# EAGLE design OpenSegment-v10 (EAGLE 6.2)
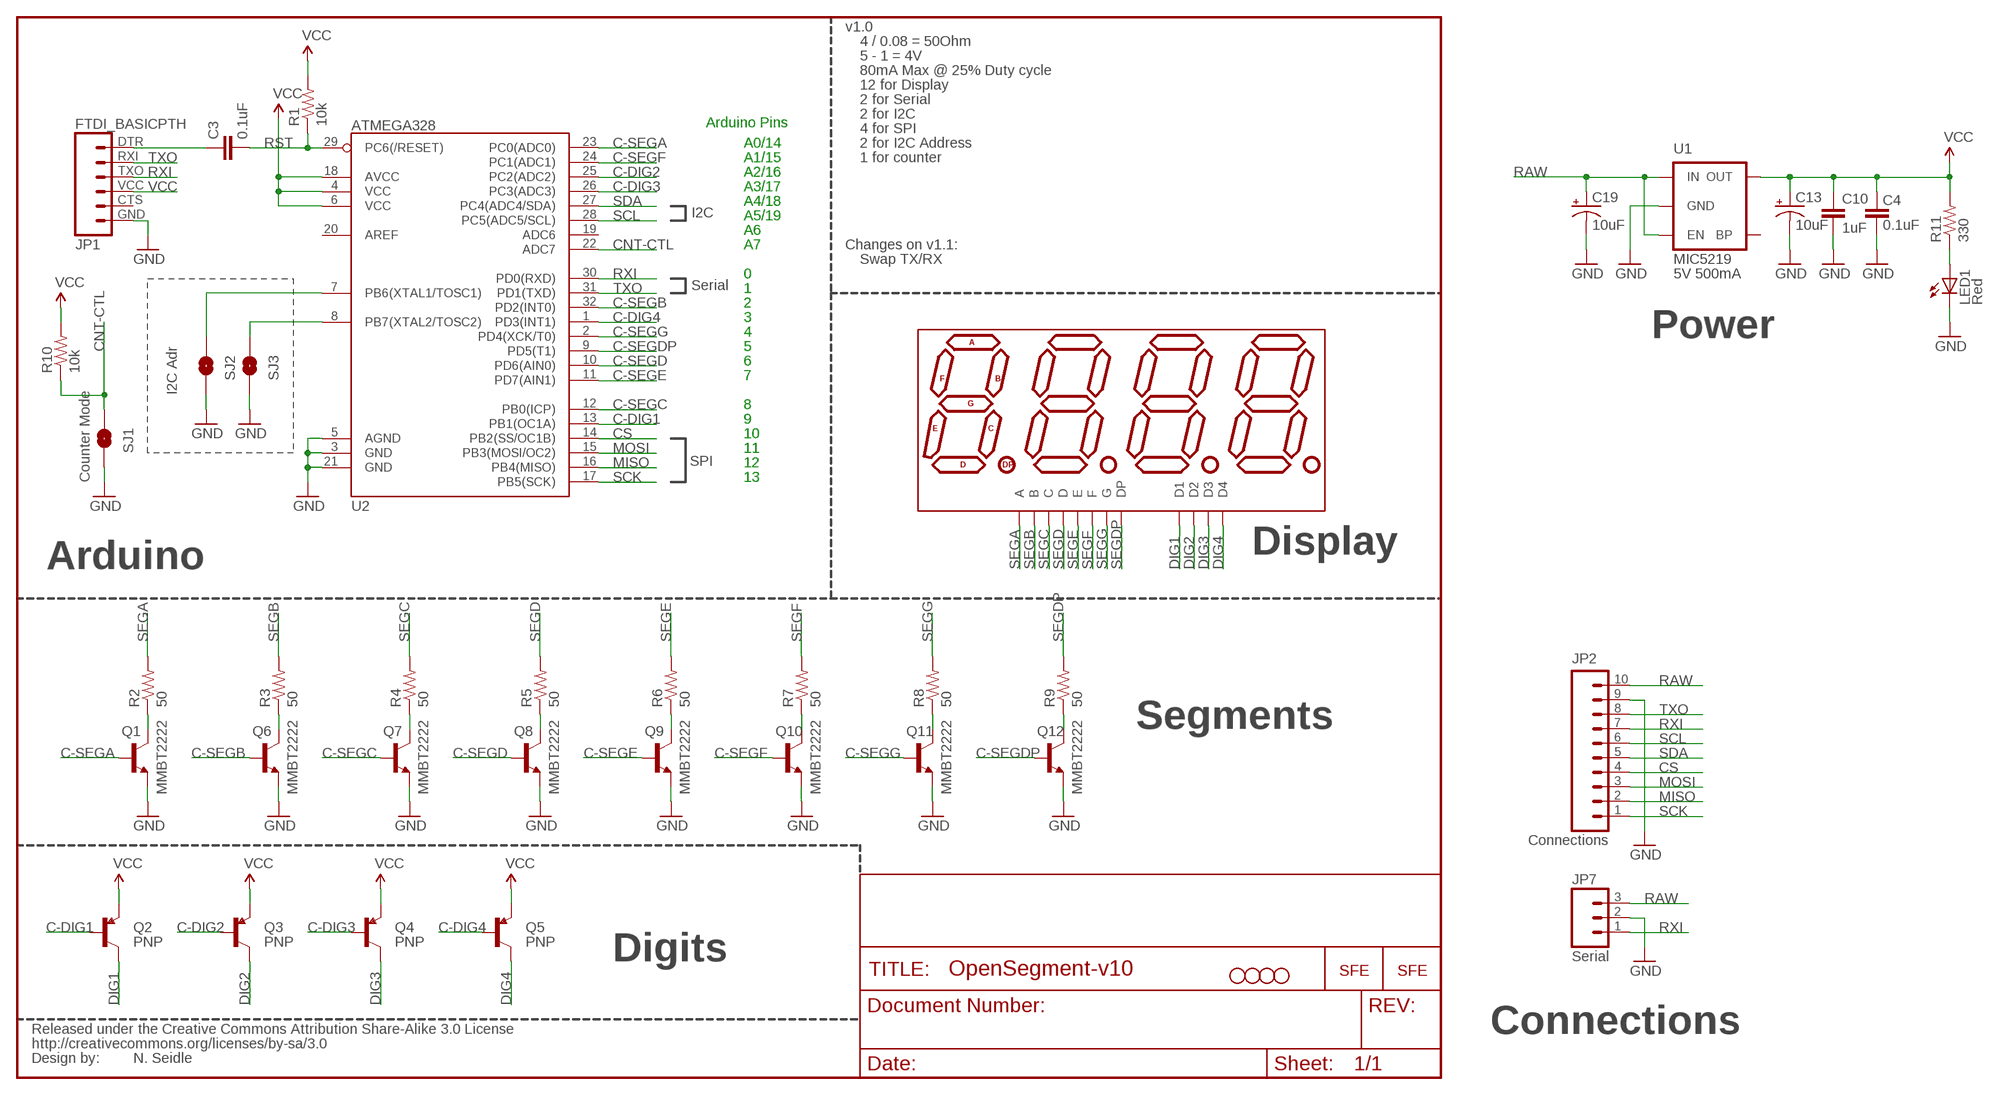
[diagram p0: schematic, sheet 1]

## Parts
C3  0.1uF  CAP0402-CAP  [0402-CAP]
C4  0.1uF  CAP0402-CAP  [0402-CAP]
C10  1uF  CAP0402-CAP  [0402-CAP]
C13  10uF  CAP_POL1206  [EIA3216]
C19  10uF  CAP_POL1206  [EIA3216]
JP1  FTDI_BASICPTH  [FTDI_BASIC]
JP2  Connections  M10"  [1X10]
JP3  STAND-OFF  [STAND-OFF]
JP4  STAND-OFF  [STAND-OFF]
JP5  STAND-OFF  [STAND-OFF]
JP6  STAND-OFF  [STAND-OFF]
JP7  Serial  M03  [JST-3-SMD]
LED1  Red  LED0603  [LED-0603]
Q1  MMBT2222  TRANSISTOR_NPNSOT23-3  [SOT23-3]
Q2  PNP  TRANSISTOR_PNPSMD  [SOT23-3]
Q3  PNP  TRANSISTOR_PNPSMD  [SOT23-3]
Q4  PNP  TRANSISTOR_PNPSMD  [SOT23-3]
Q5  PNP  TRANSISTOR_PNPSMD  [SOT23-3]
Q6  MMBT2222  TRANSISTOR_NPNSOT23-3  [SOT23-3]
Q7  MMBT2222  TRANSISTOR_NPNSOT23-3  [SOT23-3]
Q8  MMBT2222  TRANSISTOR_NPNSOT23-3  [SOT23-3]
Q9  MMBT2222  TRANSISTOR_NPNSOT23-3  [SOT23-3]
Q10  MMBT2222  TRANSISTOR_NPNSOT23-3  [SOT23-3]
Q11  MMBT2222  TRANSISTOR_NPNSOT23-3  [SOT23-3]
Q12  MMBT2222  TRANSISTOR_NPNSOT23-3  [SOT23-3]
R1  10k  RESISTOR0402-RES  [0402-RES]
R2  50  RESISTOR0402-RES  [0402-RES]
R3  50  RESISTOR0402-RES  [0402-RES]
R4  50  RESISTOR0402-RES  [0402-RES]
R5  50  RESISTOR0402-RES  [0402-RES]
R6  50  RESISTOR0402-RES  [0402-RES]
R7  50  RESISTOR0402-RES  [0402-RES]
R8  50  RESISTOR0402-RES  [0402-RES]
R9  50  RESISTOR0402-RES  [0402-RES]
R10  10k  RESISTOR0402-RES  [0402-RES]
R11  330  RESISTOR0402-RES  [0402-RES]
SJ1  Counter Ctl  SOLDERJUMPERNO  [SJ_2S-NO]
SJ2  Counter Ctl  SOLDERJUMPERNO  [SJ_2S-NO]
SJ3  Counter Ctl  SOLDERJUMPERNO  [SJ_2S-NO]
U1  MIC5219  V_REG_LDOSMD  [SOT23-5]
U2  ATMEGA328  ATMEGA168  [TQFP32-08]
U3  7-SEGMENT-4DIGIT-COUNTERPTH  [7-SEGMENT-4DIGIT-COUNTER]
U$1  LOGO-SFESK  [SFE-LOGO-FLAME]
U$3  CREATIVE_COMMONS  [CREATIVE_COMMONS]
U$7  LOGO-SFENW2  [SFE-NEW-WEB]

## Nets
C-DIG1: Q2.1(B) U2.13(PB1(OC1A))
C-DIG2: Q3.1(B) U2.25(PC2(ADC2))
C-DIG3: Q4.1(B) U2.26(PC3(ADC3))
C-DIG4: Q5.1(B) U2.1(PD3(INT1))
C-SEGA: Q1.1(B) U2.23(PC0(ADC0))
C-SEGB: Q6.1(B) U2.32(PD2(INT0))
C-SEGC: Q7.1(B) U2.12(PB0(ICP))
C-SEGD: Q8.1(B) U2.10(PD6(AIN0))
C-SEGDP: Q12.1(B) U2.9(PD5(T1))
C-SEGE: Q9.1(B) U2.11(PD7(AIN1))
C-SEGF: Q10.1(B) U2.24(PC1(ADC1))
C-SEGG: Q11.1(B) U2.2(PD4(XCK/T0))
CNT-CTL: R10.1 SJ1.1 U2.22(ADC7)
CS: JP2.4 U2.14(PB2(SS/OC1B))
DIG1: Q2.3(C) U3.12(D1)
DIG2: Q3.3(C) U3.9(D2)
DIG3: Q4.3(C) U3.8(D3)
DIG4: Q5.3(C) U3.6(D4)
GND: C4.1 C10.2 C13.C(-) C19.C(-) JP1.GND JP2.9 JP7.2 LED1.C Q1.2(E) Q6.2(E) Q7.2(E) Q8.2(E) Q9.2(E) Q10.2(E) Q11.2(E) Q12.2(E) SJ1.2 SJ2.2 SJ3.2 U1.2(GND) U2.3(GND) U2.5(AGND) U2.21(GND)
MISO: JP2.2 U2.16(PB4(MISO))
MOSI: JP2.3 U2.15(PB3(MOSI/OC2))
N$1: Q1.3(C) R2.1
N$2: SJ3.1 U2.8(PB7(XTAL2/TOSC2))
N$3: C3.1 JP1.DTR
N$4: Q6.3(C) R3.1
N$5: Q7.3(C) R4.1
N$6: Q8.3(C) R5.1
N$7: Q9.3(C) R6.1
N$8: Q10.3(C) R7.1
N$9: Q11.3(C) R8.1
N$10: Q12.3(C) R9.1
N$18: SJ2.1 U2.7(PB6(XTAL1/TOSC1))
N$38: LED1.A R11.1
RAW [vcc]: C19.A(+) JP2.10 JP7.3 U1.1(IN) U1.3(EN)
RST: C3.2 R1.1 U2.29(PC6(/RESET))
RXI: JP1.TXO JP2.7 JP7.1 U2.30(PD0(RXD))
SCK: JP2.1 U2.17(PB5(SCK))
SCL: JP2.6 U2.28(PC5(ADC5/SCL))
SDA: JP2.5 U2.27(PC4(ADC4/SDA))
SEGA: R2.2 U3.11(A)
SEGB: R3.2 U3.7(B)
SEGC: R4.2 U3.4(C)
SEGD: R5.2 U3.2(D)
SEGDP: R9.2 U3.3(DP)
SEGE: R6.2 U3.1(E)
SEGF: R7.2 U3.10(F)
SEGG: R8.2 U3.5(G)
TXO: JP1.RXI JP2.8 U2.31(PD1(TXD))
VCC: C4.2 C10.1 C13.A(+) JP1.VCC Q2.2(E) Q3.2(E) Q4.2(E) Q5.2(E) R1.2 R10.2 R11.2 U1.5(OUT) U2.4(VCC) U2.6(VCC) U2.18(AVCC)
Unconnected: JP1.CTS U1.4(BP) U2.19(ADC6) U2.20(AREF)

## Notes on the sheet
- v1.0
- 4 / 0.08 = 50Ohm
- 5 - 1 = 4V
- 80mA Max @ 25% Duty cycle
- 12 for Display
- 2 for Serial
- 2 for I2C
- Arduino Pins
- 4 for SPI
- A0/14 | 2 for I2C Address
- A1/15 | 1 for counter
- A2/16
- A3/17
- A4/18
- I2C | A5/19
- A6
- A7 | Changes on v1.1:
- Swap TX/RX
- 0 | 5V 500mA
- Serial | 1
- 2
- 3
- 4 | Power
- 5
- 6
- 7
- I2C Adr
- 8
- 9
- 10
- 11
- SPI | 12
- Counter Mode | 13
- Display
- Arduino
- Segments
- Digits
- Connections
- N. Seidle

## Library data of the parts
C3 C4 C10 = SparkFun:CAP: Capacitor Standard 0603 ceramic capacitor, and 0.1" leaded capacitor.
C13 C19 = SparkFun:CAP_POL: Capacitor Polarized These are standard SMD and PTH capacitors. Normally 10uF, 47uF, and 100uF in electrolytic and tantalum varieties. Always verify the external diameter of the through hole cap, it varies with capacity, voltage, and manufacturer. The EIA devices should be standard.
JP1 = SparkFun:FTDI_BASIC: FTDI Basic: 3.3V and 5V
JP2 = SparkFun-Connectors:M10: Header 10 Standard 10-pin 0.1" header. Use with straight break away headers (SKU : PRT-00116), right angle break away headers (PRT-00553), swiss pins (PRT-00743), machine pins (PRT-00117), and female headers (PRT-00115).
JP3-JP6 = SparkFun-Electromechanical:STAND-OFF: #4 Stand Off This is the mechanical footprint for a #4 phillips button head screw. Use the keepout ring to avoid running the screw head into surrounding components. SKU : PRT-00447
JP7 = SparkFun-Connectors:M03: Header 3 Standard 3-pin 0.1" header. Use with straight break away headers (SKU : PRT-00116), right angle break away headers (PRT-00553), swiss pins (PRT-00743), machine pins (PRT-00117), and female headers (PRT-00115). Molex polarized connector foot print use with SKU : PRT-08232 with associated crimp pins and housings.
LED1 = SparkFun:LED: LEDs Standard schematic elements and footprints for 5mm, 3mm, 1206, and 0603 sized LEDs. 5mm - Spark Fun Electronics SKU : COM-00529 (and others)
Q1 Q6-Q12 = SparkFun-DiscreteSemi:TRANSISTOR_NPN: Generic NPN BJT. MMBT2222 is the common NPN we use. Double check against datasheet- not all devices are the same!
Q2-Q5 = SparkFun-DiscreteSemi:TRANSISTOR_PNP: Generic PNP BJT. Double check pinouts against datasheets- not all devices are the same!
R1-R11 = SparkFun:RESISTOR: Resistor Basic schematic elements and footprints for 0603, 1206, and PTH resistors.
SJ1-SJ3 = SparkFun-Passives:SOLDERJUMPER: Solder Jumper Standard SMD solder jumper. Used to automate production. Two varients : Normally Open and Normally Closed are the same, but have different paste layers. NC will have a large amount of paste and should jumper during reflow.
U1 = SparkFun:V_REG_LDO: Voltage Regulator LDO Standard 150mA LDO voltage regulator in SOT-23 layout. Micrel part MIC5205. BP (by-pass) pin is used to lower output noise with 470pF cap.
U2 = SparkFun-DigitalIC:ATMEGA168: Atmel 32-pin 8-bit micro, 16k flash.
U3 = SparkFun-Displays:7-SEGMENT-4DIGIT-COUNTER
U$1 U$7 = SparkFun:LOGO-SFE: Spark Fun Electronics PCB Logo This is the standard Spark Fun Electronics PCB logo.
U$3 = SparkFun:CREATIVE_COMMONS

## Net classes
0 default: width 0.203 mm

## Board
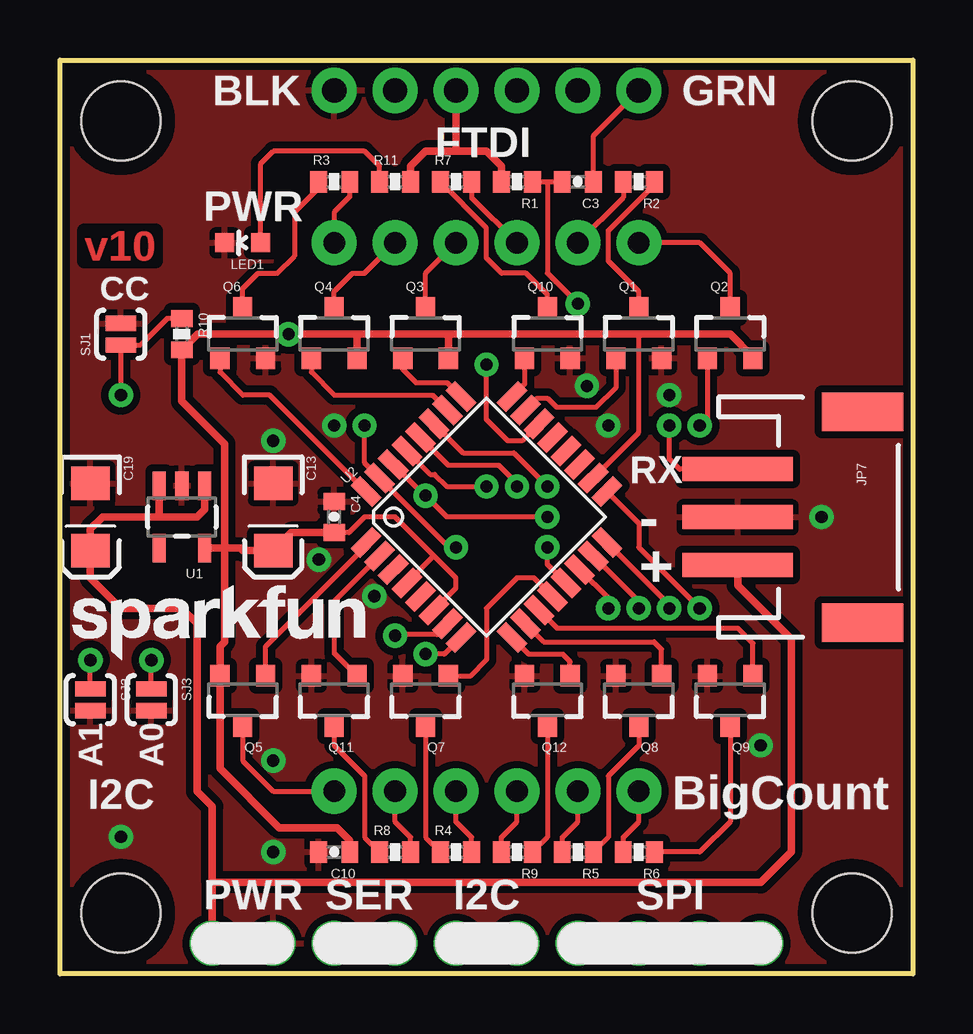
[diagram p1: board, top side]
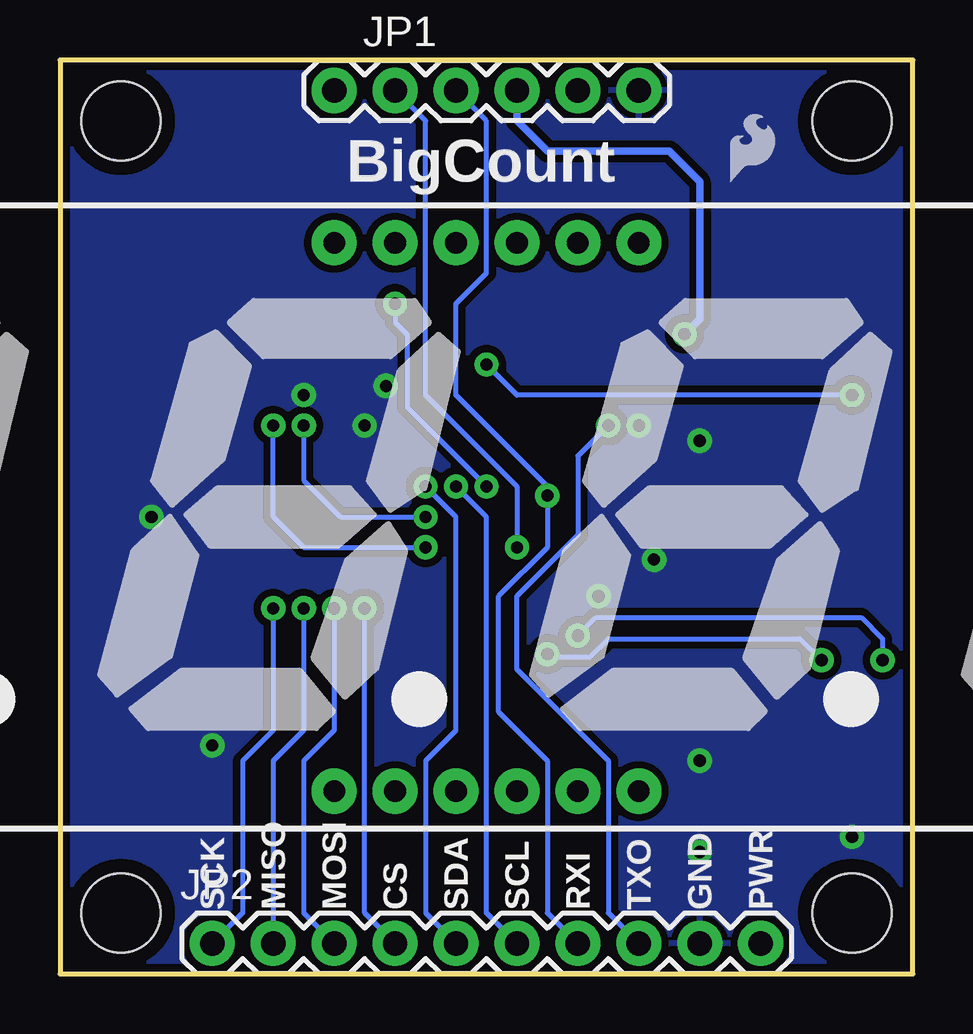
[diagram p2: board, bottom side, seen from below]

Size 35.56 x 38.1 mm. Coordinates in mm from the lower left corner, seen from the top.
Outline: 35.56,38.1 35.56,0 0,0 0,38.1 35.56,38.1
Copper layers (1*16): Top 0.035mm / dielectric 1.5mm / Bottom 0.035mm
Design rules: minimum track width 8mil, minimum drill 20mil, track to track 8mil, track to pad 8mil, pad to pad 8mil, via to via 8mil, smd to smd 8mil, copper to edge 10mil, drill to drill 8mil, minimum pad ring 12mil, minimum via ring 10mil, stop-mask expansion 4mil, vias tented up to drill 20mil, thermal gap 10mil

### Footprints (pad centres in the part's own frame; a part is rotated, then mirrored left to right if it is on the bottom)
0402-CAP = smd 0.7 x 0.9: 1 -0.65,0; 2 0.65,0
EIA3216 = smd 1.4 x 1.6: A 1.4,0; C -1.4,0
FTDI_BASIC = drill 1.016 pad 1.88: CTS 10.16,0; DTR 0,0; GND 12.7,0; RXI 2.54,0; TXO 5.08,0; VCC 7.62,0
1X10 = drill 1.016 pad 1.88: 1 0,0; 2 2.54,0; 3 5.08,0; 4 7.62,0; 5 10.16,0; 6 12.7,0; 7 15.24,0; 8 17.78,0; 9 20.32,0; 10 22.86,0
STAND-OFF = hole 3.302: 0,0
JST-3-SMD = smd 1 x 4.6: 1 -1.99,-4.77; 2 0.01,-4.77; 3 2.01,-4.77 | smd 1.6 x 3.4: NC1 -4.39,0.43; NC2 4.41,0.43
LED-0603 = smd 0.8 x 0.8: A 0,-0.75; C 0,0.75
SOT23-3 = smd 0.8 x 0.9: 1 -0.95,-1; 2 0.95,-1; 3 0,1.1
0402-RES = smd 0.7 x 0.9: 1 -0.65,0; 2 0.65,0
SJ_2S-NO = smd 0.635 x 1.27: 1 -0.45,0; 2 0.45,0
SOT23-5 = smd 0.55 x 1.2: 1 -0.95,-1.3; 2 0,-1.3; 3 0.95,-1.3; 4 0.95,1.3; 5 -0.95,1.3
TQFP32-08 = smd 1.27 x 0.559: 1 -4.293,2.8; 2 -4.293,2; 3 -4.293,1.2; 4 -4.293,0.4; 5 -4.293,-0.4; 6 -4.293,-1.2; 7 -4.293,-2; 8 -4.293,-2.8; 17 4.293,-2.8; 18 4.293,-2; 19 4.293,-1.2; 20 4.293,-0.4; 21 4.293,0.4; 22 4.293,1.2; 23 4.293,2; 24 4.293,2.8 | smd 0.559 x 1.27: 9 -2.8,-4.293; 10 -2,-4.293; 11 -1.2,-4.293; 12 -0.4,-4.293; 13 0.4,-4.293; 14 1.2,-4.293; 15 2,-4.293; 16 2.8,-4.293; 25 2.8,4.293; 26 2,4.293; 27 1.2,4.293; 28 0.4,4.293; 29 -0.4,4.293; 30 -1.2,4.293; 31 -2,4.293; 32 -2.8,4.293
7-SEGMENT-4DIGIT-COUNTER = drill 0.9 pad 1.88: 1 -6.35,-11.43; 2 -3.81,-11.43; 3 -1.27,-11.43; 4 1.27,-11.43; 5 3.81,-11.43; 6 6.35,-11.43; 7 6.35,11.43; 8 3.81,11.43; 9 1.27,11.43; 10 -1.27,11.43; 11 -3.81,11.43; 12 -6.35,11.43

### Placement (x,y rotation side)
C3  21.59,33.02 180 top
C4  11.43,19.05 270 top
C10  11.43,5.08 180 top
C13  8.89,19.05 270 top
C19  1.27,19.05 270 top
JP1  24.13,36.83 0 bottom
JP2  29.21,1.27 0 bottom
JP3  33.02,35.56 0 top
JP4  2.54,35.56 0 top
JP5  33.02,2.54 0 top
JP6  2.54,2.54 0 top
JP7  33.02,19.05 270 top
LED1  7.62,30.48 90 top
Q1  24.13,26.67 0 top
Q2  27.94,26.67 0 top
Q3  15.24,26.67 0 top
Q4  11.43,26.67 0 top
Q5  7.62,11.43 180 top
Q6  7.62,26.67 0 top
Q7  15.24,11.43 180 top
Q8  24.13,11.43 180 top
Q9  27.94,11.43 180 top
Q10  20.32,26.67 0 top
Q11  11.43,11.43 180 top
Q12  20.32,11.43 180 top
R1  19.05,33.02 180 top
R2  24.13,33.02 180 top
R3  11.43,33.02 0 top
R4  16.51,5.08 0 top
R5  21.59,5.08 180 top
R6  24.13,5.08 180 top
R7  16.51,33.02 0 top
R8  13.97,5.08 0 top
R9  19.05,5.08 180 top
R10  5.08,26.67 270 top
R11  13.97,33.02 0 top
SJ1  2.54,26.67 90 top
SJ2  1.27,11.43 270 top
SJ3  3.81,11.43 270 top
U1  5.08,19.05 180 top
U2  17.78,19.05 45 top
U3  17.78,19.05 0 bottom
U$1  7.62,33.02 0 bottom
U$3  -6.35,-12.7 0 top  (outside the outline)
U$7  0.51,13.08 0 top

### Tracks (layer width: path | path; a pad name or v marks a point on that pad's centre or on a via)
C-DIG1  (via drill 0.51)
  Top 0.203: U2.13 20.32,17.08 v20.32,17.78 | Q2.1 26.99,23.18 v26.67,22.86
  Bottom 0.203: v20.32,17.78 25.4,17.78 26.67,19.05 v26.67,22.86
C-DIG2
  Top 0.203: U2.25 16.15,24.64 14.86,24.64 14.29,25.21 Q3.1
C-DIG3
  Top 0.203: U2.26 15.53,24.13 11.43,24.13 10.48,25.08 Q4.1
C-DIG4
  Top 0.203: U2.1 12.77,17.84 8.57,13.65 Q5.1
C-SEGA
  Top 0.203: Q1.1 23.18,24.45 22.35,23.62 20.7,23.62 20.32,24 19.91,24 U2.23
C-SEGB
  Top 0.203: Q6.1 6.67,25.08 7.62,24.13 8.74,24.13 U2.32
C-SEGC
  Top 0.203: U2.12 19.75,16.51 19.05,16.51 17.78,15.24 17.78,13.08 17.13,12.43 Q7.1
C-SEGD
  Top 0.203: U2.10 20.16,13.84 24.77,13.84 25.08,13.53 Q8.1
C-SEGDP
  Top 0.203: U2.9 19.54,13.34 20.96,13.34 21.27,13.02 Q12.1
C-SEGE
  Top 0.203: U2.11 20.72,14.41 28.26,14.41 28.89,13.78 Q9.1
C-SEGF
  Top 0.203: Q10.1 19.37,24.6 U2.24
C-SEGG
  Top 0.203: U2.2 11.43,15.53 11.43,13.38 Q11.1
CNT-CTL  (via drill 0.51)
  Top 0.203: U2.22 19.26,22.23 18.67,22.23 17.78,23.11 v17.78,25.4 | v2.54,24.13 SJ1.1 3.36,26.22 4.46,27.32 R10.1
  Bottom 0.203: v2.54,24.13 16.51,24.13 v17.78,25.4
CS  (via drill 0.51)
  Top 0.203: U2.14 22.86,15.67 v22.86,15.24
  Bottom 0.203: v22.86,15.24 22.86,2.54 JP2.4
DIG1
  Top 0.203: Q2.3 27.94,29.21 26.67,30.48 U3.12
DIG2
  Top 0.203: Q3.3 15.24,29.21 U3.9
DIG3
  Top 0.203: Q4.3 11.43,28.45 12.19,29.21 12.7,29.21 U3.8
DIG4
  Top 0.203: Q5.3 7.62,8.89 8.89,7.62 U3.6
GND  (via drill 0.51)
  other vias: 25.4,24.13 21.97,24.51 22.86,22.86 31.75,19.05 29.21,9.53 8.89,8.89 2.54,5.71 8.89,5.08 13.11,15.75 8.89,22.23 11.43,22.86 10.8,17.27
  pour Top (isolate 0.305): 0,0 0,38.1 35.56,38.1 35.56,0
  pour Bottom (isolate 0.305): 0,0 0,38.1 35.56,38.1 35.56,0
MISO  (via drill 0.51)
  Top 0.203: U2.16 25.4,15.39 v25.4,15.24
  Bottom 0.203: v25.4,15.24 25.4,10.16 26.67,8.89 JP2.2
MOSI  (via drill 0.51)
  Top 0.203: U2.15 24.13,15.53 v24.13,15.24
  Bottom 0.203: v24.13,15.24 24.13,10.16 25.4,8.89 25.4,2.54 JP2.3
N$1
  Top 0.203: R2.1 24.78,32.91 22.86,30.99 22.86,29.72 24.13,28.45 Q1.3
N$2  (via drill 0.51)
  Top 0.203: SJ3.1 v3.81,13.08 | U2.8 16.03,13.34 v15.24,13.34
  Bottom 0.203: v3.81,13.08 4.7,13.97 12.7,13.97 13.46,13.21 14.99,13.21 15.11,13.34 v15.24,13.34
N$3
  Top 0.203: C3.1 22.24,34.94 JP1.DTR
N$4
  Top 0.203: R3.1 10.78,32.75 9.78,31.75 9.78,29.93 9.06,29.21 8.26,29.21 7.62,28.58 Q6.3
N$5
  Top 0.203: Q7.3 15.24,5.7 R4.1
N$6
  Top 0.203: R5.1 22.86,5.7 22.86,8.26 24.13,9.53 Q8.3
N$7
  Top 0.203: Q9.3 27.94,6.35 26.67,5.08 R6.1
N$8
  Top 0.203: R7.1 17.78,31.1 17.78,29.84 18.42,29.21 19.43,29.21 20.32,28.32 Q10.3
N$9
  Top 0.203: R8.1 12.7,5.7 12.7,8.26 11.43,9.53 Q11.3
N$10
  Top 0.203: Q12.3 20.32,5.7 R9.1
N$18  (via drill 0.51)
  Top 0.203: SJ2.1 v1.27,13.08 | U2.7 15.71,14.15 14.02,14.15 v13.97,14.1
  Bottom 0.203: v1.27,13.08 1.27,13.97 2.16,14.86 13.21,14.86 v13.97,14.1
N$38
  Top 0.203: R11.1 13.32,33.67 12.7,34.29 8.89,34.29 8.37,33.77 LED1.A
RAW
  Top 0.305: 6.35,3.81 6.35,6.99 5.72,7.62 5.72,14.61 5.08,15.24 2.54,15.24 1.27,16.51 C19.A 1.27,18.54 1.78,19.05 4.19,19.05 | U1.1 6.03,19.37 5.72,19.05 4.19,19.05 | U1.3 4.13,19.11 4.19,19.05 | JP7.3 28.25,16.2 30.48,13.97 30.48,5.08 29.21,3.81 6.35,3.81 | 6.35,3.81 JP2.10
RST  (via drill 0.51)
  Top 0.203: R1.1 20.32,33.02 | 20.32,33.02 C3.2 | 20.32,33.02 20.32,29.21 v21.59,27.94 | U2.29 15.44,20.83 15.62,20.83 16.13,20.32 v17.78,20.32
  Bottom 0.203: v17.78,20.32 21.08,23.62 21.08,26.67 21.59,27.18 v21.59,27.94
RXI  (via drill 0.51)
  Top 0.203: U2.30 15.19,19.94 v15.24,19.94 16.13,19.05 v20.32,19.05 | JP7.1 25.82,21.04 25.4,21.46 v25.4,22.86
  Bottom 0.203: v20.32,19.05 23.88,19.05 25.4,20.57 v25.4,22.86 | JP2.7 15.24,2.54 15.24,8.89 17.27,10.92 17.27,15.75 15.24,17.78 v15.24,19.94 15.24,20.32 19.05,24.13 19.05,27.94 17.78,29.21 17.78,35.56 JP1.TXO
SCK  (via drill 0.51)
  Top 0.203: U2.17 24.13,18.77 24.13,17.78 v26.67,15.24
  Bottom 0.203: v26.67,15.24 26.67,10.16 27.94,8.89 27.94,2.54 JP2.1
SCL  (via drill 0.51)
  Top 0.203: U2.28 16.19,21.21 18.29,21.21 19.05,20.45 v19.05,20.32
  Bottom 0.203: v19.05,20.32 17.78,19.05 17.78,2.54 JP2.6
SDA  (via drill 0.51)
  Top 0.203: U2.27 16.81,21.72 18.92,21.72 v20.32,20.32
  Bottom 0.203: v20.32,20.32 19.05,19.05 19.05,10.16 20.32,8.89 20.32,2.54 JP2.5
SEGA
  Top 0.203: U3.11 23.48,32.37 R2.2
SEGB
  Top 0.203: R3.2 12.08,32.4 11.43,31.75 U3.7
SEGC
  Top 0.203: R4.2 17.16,5.7 16.51,6.35 U3.4
SEGD
  Top 0.203: R5.2 20.94,5.7 21.59,6.35 U3.2
SEGDP
  Top 0.203: R9.2 18.4,5.7 19.05,6.35 U3.3
SEGE
  Top 0.203: R6.2 23.48,5.7 24.13,6.35 U3.1
SEGF
  Top 0.203: U3.10 17.16,32.37 R7.2
SEGG
  Top 0.203: R8.2 14.62,5.7 13.97,6.35 U3.5
TXO  (via drill 0.51)
  Top 0.203: v16.51,17.78 16.22,17.78 U2.31 12.7,21.3 v12.7,22.86
  Bottom 0.203: v16.51,17.78 16.51,20.32 20.32,24.13 20.32,35.56 JP1.RXI | v12.7,22.86 13.97,21.59 13.97,18.29 16.51,15.75 16.51,12.7 12.7,8.89 12.7,2.54 JP2.8
VCC  (via drill 0.51)
  Top 0.203: U2.18 24.13,22.57 24.13,26.67 | U2.4 15.56,17.39 15.56,17.46 | C4.2 12.05,18.4 12.7,19.05 13.97,19.05 15.56,17.46 | U2.6 16.51,16.08 16.51,16.51 15.56,17.46
  Top 0.305: Q4.2 12.38,26.6 12.45,26.67 | 12.45,26.67 16.13,26.67 | 16.13,26.67 24.13,26.67 27.94,26.67 28.89,25.72 Q2.2 | Q3.2 16.19,26.61 16.13,26.67 | R1.2 18.4,33.67 17.78,34.29 16.51,34.29 | R11.2 14.62,33.67 15.24,34.29 16.51,34.29 | 12.45,26.67 v9.53,26.67 5.73,26.67 R10.2 5.08,23.88 6.86,22.1 6.86,17.75 | U1.5 6.86,17.75 | 6.86,17.75 7.52,17.75 7.62,17.65 C13.A 9.64,18.4 C4.2 | 6.86,17.75 6.86,13.84 6.67,13.66 Q5.2 6.67,8.57 9.14,6.1 11.56,6.1 12.08,5.57 C10.1 | 16.51,34.29 JP1.VCC
  Bottom 0.305: JP1.VCC 16.51,35.56 15.24,34.29 10.16,34.29 8.89,33.02 8.89,27.3 v9.53,26.67

### Text on the board
Top: v10
tPlace: BLK | GRN | FTDI | PWR | CC | RX | - | + | A1 | A0 | I2C | BigCount | PWR | SER | I2C | SPI | N. Seidle
bPlace: BigCount | PWR | GND | TXO | RXI | SCL | SDA | CS | MOSI | MISO | SCK